# EAGLE design 1541-3z (EAGLE 6.6.0)
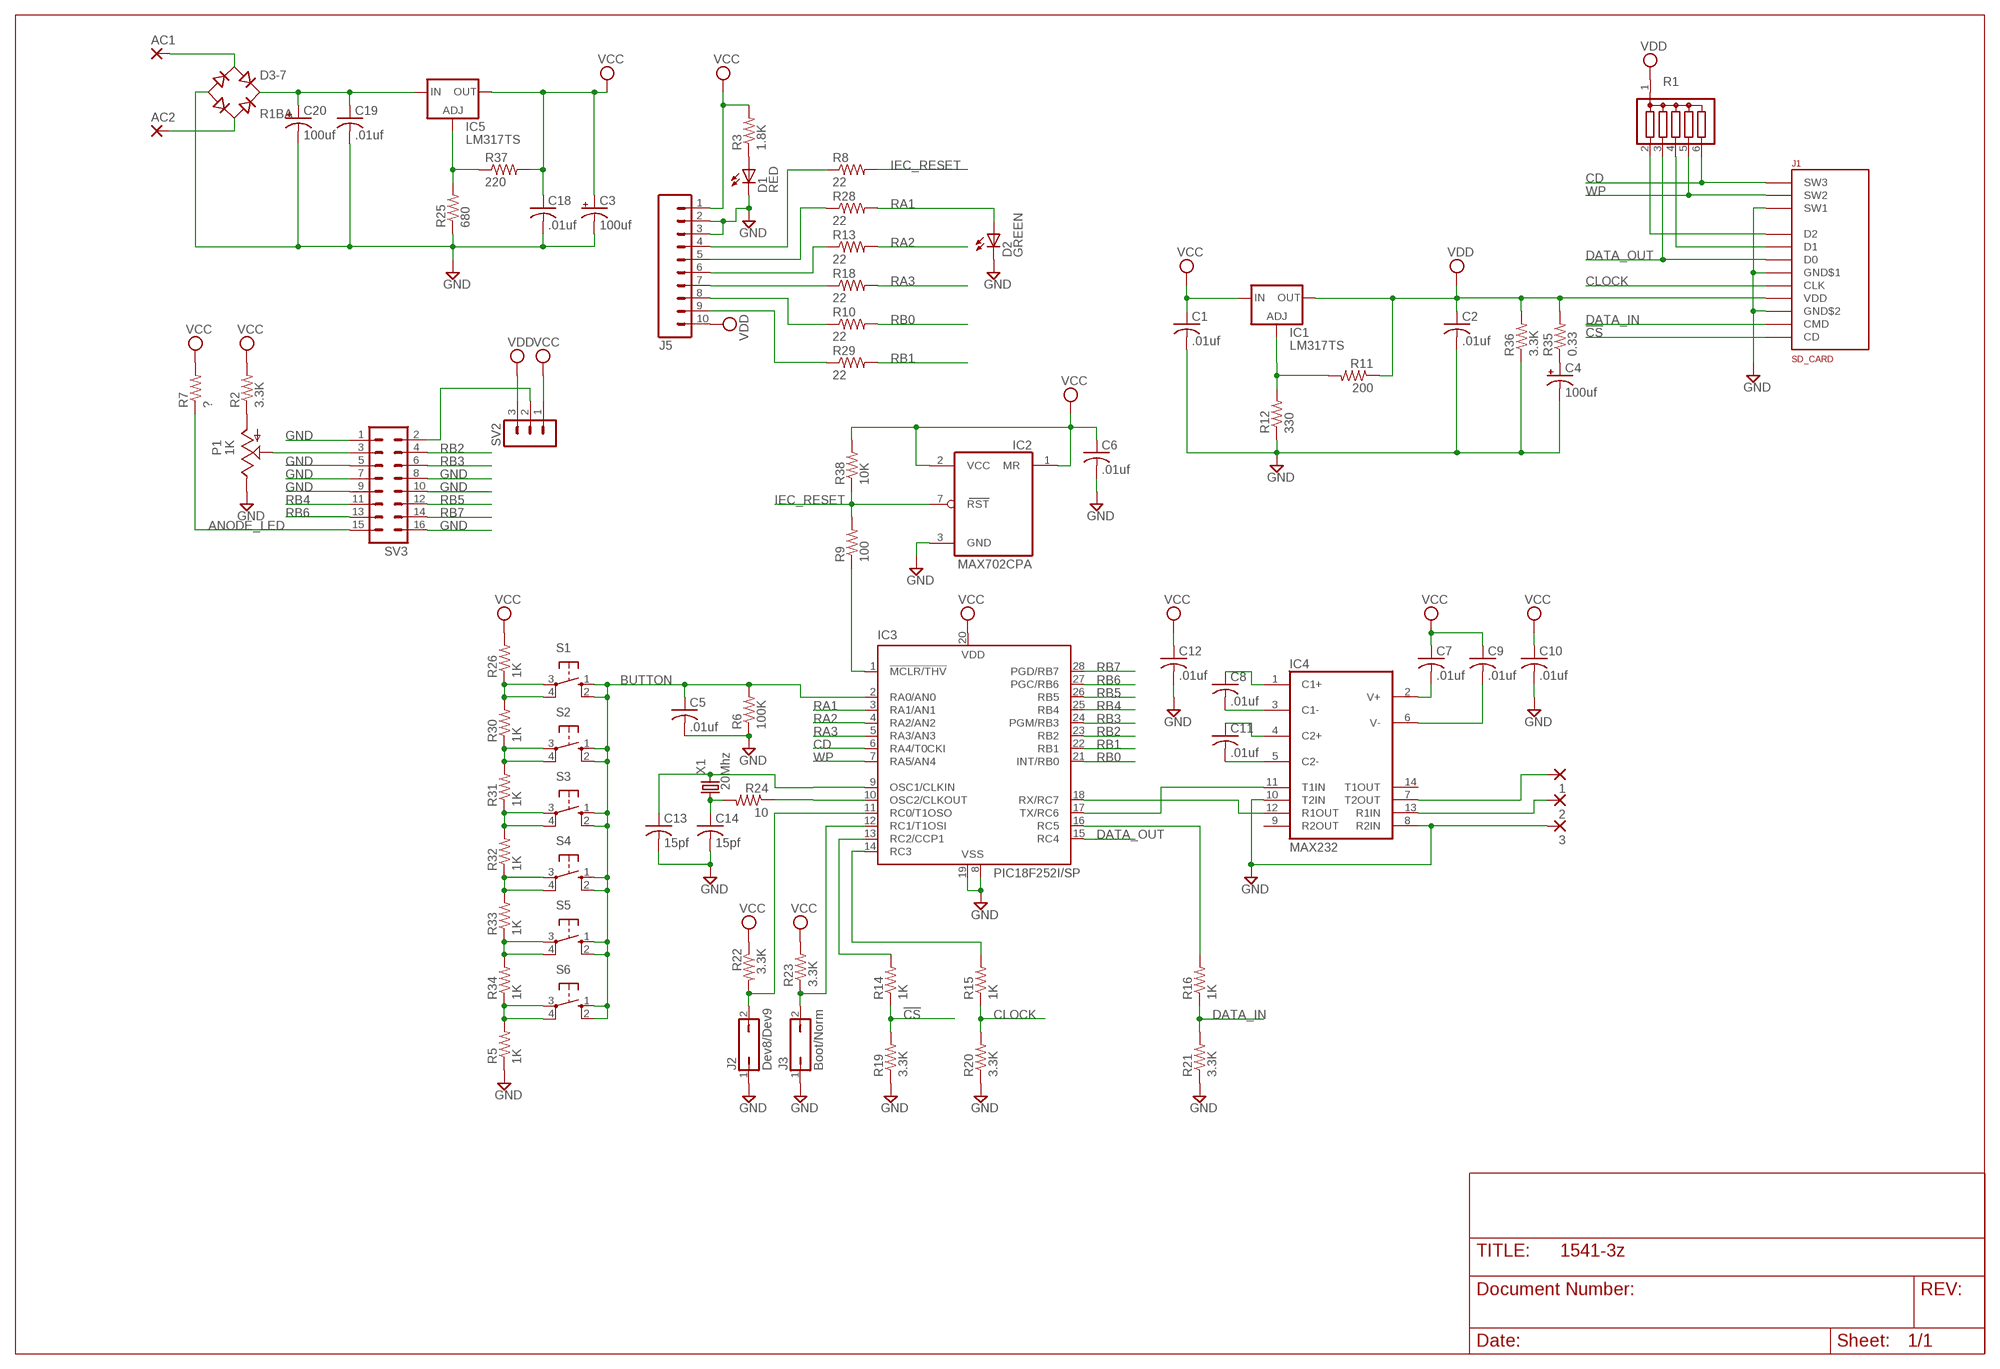
[diagram p0: schematic, sheet 1]

## Parts
1  2,15/1,0  [2,15/1,0]
2  2,15/1,0  [2,15/1,0]
3  2,15/1,0  [2,15/1,0]
AC1  2,15/1,0  [2,15/1,0]
AC2  2,15/1,0  [2,15/1,0]
C1  .01uf  C-US025-024X044  [C025-024X044]
C2  .01uf  C-US025-024X044  [C025-024X044]
C3  100uf  CPOL-USE2-5  [E2-5]
C4  100uf  CPOL-USE2-5  [E2-5]
C5  .01uf  C-US025-024X044  [C025-024X044]
C6  .01uf  C-US025-024X044  [C025-024X044]
C7  .01uf  C-US025-024X044  [C025-024X044]
C8  .01uf  C-US025-024X044  [C025-024X044]
C9  .01uf  C-US025-024X044  [C025-024X044]
C10  .01uf  C-US025-024X044  [C025-024X044]
C11  .01uf  C-US025-024X044  [C025-024X044]
C12  .01uf  C-US025-024X044  [C025-024X044]
C13  15pf  C-US025-024X044  [C025-024X044]
C14  15pf  C-US025-024X044  [C025-024X044]
C18  .01uf  C-US025-024X044  [C025-024X044]
C19  .01uf  C-US025-024X044  [C025-024X044]
C20  100uf  CPOL-USE2-5  [E2-5]
D1  RED  LED3MM  [LED3MM]
D2  GREEN  LED3MM  [LED3MM]
D3-7  R1BA  RB1A  [RB1A]
IC1  LM317TS  [317TS]
IC2  MAX702CPA  [DIL08]
IC3  PIC18F252I/SP  PIC16F870P  [DIL28-3]
IC4  MAX232  [DIL16]
IC5  LM317TS  [317TS]
J1  SD_CARD  [SD_CARD]
J2  Dev8/Dev9  JP1Q  [JP1]
J3  Boot/Norm  JP1Q  [JP1]
J5  M10  [10P]
P1  1K  TRIM_US-LI10  [LI10]
R1  G05R  [SIL6]
R2  3.3K  R-US_0207/2V  [0207/2V]
R3  1.8K  R-US_0207/2V  [0207/2V]
R5  1K  R-US_0207/2V  [0207/2V]
R6  100K  R-US_0207/2V  [0207/2V]
R7  ?  R-US_0207/2V  [0207/2V]
R8  22  R-US_0207/2V  [0207/2V]
R9  100  R-US_0207/2V  [0207/2V]
R10  22  R-US_0207/2V  [0207/2V]
R11  200  R-US_0207/2V  [0207/2V]
R12  330  R-US_0207/2V  [0207/2V]
R13  22  R-US_0207/2V  [0207/2V]
R14  1K  R-US_0207/2V  [0207/2V]
R15  1K  R-US_0207/2V  [0207/2V]
R16  1K  R-US_0207/2V  [0207/2V]
R18  22  R-US_0207/2V  [0207/2V]
R19  3.3K  R-US_0207/2V  [0207/2V]
R20  3.3K  R-US_0207/2V  [0207/2V]
R21  3.3K  R-US_0207/2V  [0207/2V]
R22  3.3K  R-US_0207/2V  [0207/2V]
R23  3.3K  R-US_0207/2V  [0207/2V]
R24  10  R-US_0207/2V  [0207/2V]
R25  680  R-US_0207/2V  [0207/2V]
R26  1K  R-US_0207/2V  [0207/2V]
R28  22  R-US_0207/2V  [0207/2V]
R29  22  R-US_0207/2V  [0207/2V]
R30  1K  R-US_0207/2V  [0207/2V]
R31  1K  R-US_0207/2V  [0207/2V]
R32  1K  R-US_0207/2V  [0207/2V]
R33  1K  R-US_0207/2V  [0207/2V]
R34  1K  R-US_0207/2V  [0207/2V]
R35  0.33  R-US_0207/2V  [0207/2V]
R36  3.3K  R-US_0207/2V  [0207/2V]
R37  220  R-US_0207/2V  [0207/2V]
R38  10K  R-US_0207/2V  [0207/2V]
S1  10-XX  [B3F-10XX]
S2  10-XX  [B3F-10XX]
S3  10-XX  [B3F-10XX]
S4  10-XX  [B3F-10XX]
S5  10-XX  [B3F-10XX]
S6  10-XX  [B3F-10XX]
SV2  MA03-1  [MA03-1]
SV3  ML16  [ML16]
X1  20Mhz  CRYSTALHC49U70  [HC49U70]

## Nets
!CS: J1.DAT3(CD) R14.1 R19.2
ANODE_LED: R7.1 SV3.15
BUTTON: C5.1 IC3.2(RA0/AN0) R6.2 S1.1(S) S1.2(S1) S2.1(S) S2.2(S1) S3.1(S) S3.2(S1) S4.1(S) S4.2(S1) S5.1(S) S5.2(S1) S6.1(S) S6.2(S1)
CD: IC3.6(RA4/T0CKI) J1.SW3 R1.6
CLOCK: J1.CLK R15.1 R20.2
DATA_IN: J1.CMD R16.1 R21.2
DATA_OUT: IC3.15(RC4) J1.DAT0(D0) R1.3
GND: 3.1(P) C1.2 C2.2 C3.- C4.- C5.2 C6.2 C10.2 C12.2 C13.2 C14.2 C18.2 C19.2 C20.- D1.K(C) D2.K(C) D3-7.- IC2.3(GND) IC3.8(VSS) IC3.19(VSS) IC4.8(R2IN) IC4.10(T2IN) J1.SW1 J1.VSS$1(GND$1) J1.VSS$2(GND$2) J2.1 J3.1 J5.2 J5.3 P1.E R5.1 R6.1 R12.1 R19.1 R20.1 R21.1 R25.1 R36.1 SV3.1 SV3.5 SV3.7 SV3.8 SV3.9 SV3.10 SV3.16
IEC_RESET: IC2.7(RST) R8.2 R9.2 R38.1
N$1: C4.+ R35.1
N$2: J1.DAT2(D2) R1.2
N$3: J1.DAT1(D1) R1.4
N$4: J5.9 R29.1
N$5: J5.8 R10.1
N$6: J5.7 R18.1
N$7: J5.4 R8.1
N$8: J5.5 R28.1
N$9: J5.6 R13.1
N$10: D1.A R3.1
N$11: IC3.18(RX/RC7) IC4.12(R1OUT)
N$12: IC3.14(RC3) R15.2
N$13: C14.1 R24.2 X1.1
N$14: IC3.1(!MCLR/THV) R9.1
N$15: C11.1 IC4.4(C2+)
N$16: C11.2 IC4.5(C2-)
N$17: C8.2 IC4.3(C1-)
N$18: C8.1 IC4.1(C1+)
N$19: C7.2 IC4.2(V+)
N$20: C13.1 IC3.9(OSC1/CLKIN) X1.2
N$21: IC3.10(OSC2/CLKOUT) R24.1
N$22: IC3.12(RC1/T1OSI) J3.2 R23.1
N$23: IC3.11(RC0/T1OSO) J2.2 R22.2
N$24: IC3.13(RC2/CCP1) R14.2
N$25: IC3.16(RC5) R16.2
N$26: IC1.1(ADJ) R11.2 R12.2
N$27: IC3.17(TX/RC6) IC4.11(T1IN)
N$28: R26.1 R30.2 S1.3(P) S1.4(P1)
N$29: R30.1 R31.2 S2.3(P) S2.4(P1)
N$30: R31.1 R32.2 S3.3(P) S3.4(P1)
N$31: R5.2 R34.1 S6.3(P) S6.4(P1)
N$32: R33.1 R34.2 S5.3(P) S5.4(P1)
N$33: R32.1 R33.2 S4.3(P) S4.4(P1)
N$34: P1.A R2.1
N$35: SV2.2 SV3.2
N$36: P1.S SV3.3
N$37: C9.2 IC4.6(V-)
N$38: IC5.1(ADJ) R25.2 R37.1
N$39: AC1.1(P) D3-7.AC1
N$40: C19.1 C20.+ D3-7.+ IC5.3(IN)
N$41: AC2.1(P) D3-7.AC2
N$42: 2.1(P) IC4.13(R1IN)
N$43: 1.1(P) IC4.7(T2OUT)
RA1: D2.A IC3.3(RA1/AN1) R28.2
RA2: IC3.4(RA2/AN2) R13.2
RA3: IC3.5(RA3/AN3) R18.2
RB0: IC3.21(INT/RB0) R10.2
RB1: IC3.22(RB1) R29.2
RB2: IC3.23(RB2) SV3.4
RB3: IC3.24(PGM/RB3) SV3.6
RB4: IC3.25(RB4) SV3.11
RB5: IC3.26(RB5) SV3.12
RB6: IC3.27(PGC/RB6) SV3.13
RB7: IC3.28(PGD/RB7) SV3.14
VCC: C1.1 C3.+ C6.1 C7.1 C9.1 C10.1 C12.1 C18.1 IC1.3(IN) IC2.1(MR) IC2.2(VCC) IC3.20(VDD) IC5.2(OUT) J5.1 R2.2 R3.2 R7.2 R22.1 R23.2 R26.2 R37.2 R38.2 SV2.1
VDD: C2.1 IC1.2(OUT) J1.VDD J5.10 R1.1 R11.1 R35.2 R36.2 SV2.3
WP: IC3.7(RA5/AN4) J1.SW2 R1.5
Unconnected: IC4.9(R2OUT) IC4.14(T1OUT)

## Power pins joined to a net without a drawn wire
GND: IC4.15(GND)
VCC: IC4.16(VCC)

## Library data of the parts
1-3 AC1 AC2 = wirepad:2,15/1,0: THROUGH-HOLE PAD
C1 C2 C5-C14 C18 C19 = rcl:C-US: CAPACITOR, American symbol
C3 C4 C20 = rcl:CPOL-US: POLARIZED CAPACITOR, American symbol
D1 D2 = led:LED: LED OSRAM: - CHIPLED LG R971, LG N971, LY N971, LG Q971, LY Q971, LO R971, LY R971 LH N974, LH R974 LS Q976, LO Q976, LY Q976 LO Q996 - Hyper CHIPLED LW Q18S LB Q993, LB Q99A, LB R99A - SideLED LS A670, LO A670, LY A670, LG A670, LP A670 LB A673, LV A673, LT A673, LW A673 LH A674 LY A675 LS A676, LA A676, LO A676, LY A676, LW A676 LS A679, LY A679, LG A679 - Hyper Micro SIDELED® LS Y876, LA Y876, LO Y876, LY Y876 LT Y87S - SmartLED LW L88C, LW L88S LB L89C, LB L89S, LG L890 LS L89K, LO L89K, LY L89K LS L896, LA L896, LO L896, LY L896 - TOPLED LS T670, LO T670, LY T670, LG T670, LP T670 LSG T670, LSP T670, LSY T670, LOP T670, LYG T670 LG T671, LOG T671, LSG T671 LB T673, LV T673, LT T673, LW T673 LH T674 LS T676, LA T676, LO T676, LY T676, LB T676, LH T676, LSB T676, LW T676 LB T67C, LV T67C, LT T67C, LS T67K, LO T67K, LY T67K, LW E67C LS E67B, LA E67B, LO E67B, LY E67B, LB E67C, LV E67C, LT E67C LW T67C LS T679, LY T679, LG T679 LS T770, LO T770, LY T770, LG T770, LP T770 LB T773, LV T773, LT T773, LW T773 LH T774 LS E675, LA E675, LY E675, LS T675 LS T776, LA T776, LO T776, LY T776, LB T776 LHGB T686 LT T68C, LB T68C - Hyper Mini TOPLED® LB M676 - Mini TOPLED Santana® LG M470 LS M47K, LO M47K, LY M47K Source: http://www.osram.convergy.de LUXEON: - LUMILED® LXK2-PW12-R00, LXK2-PW12-S00, LXK2-PW14-U00, LXK2-PW14-V00 LXK2-PM12-R00, LXK2-PM12-S00, LXK2-PM14-U00 LXK2-PE12-Q00, LXK2-PE12-R00, LXK2-PE12-S00, LXK2-PE14-T00, LXK2-PE14-U00 LXK2-PB12-K00, LXK2-PB12-L00, LXK2-PB12-M00, LXK2-PB14-N00, LXK2-PB14-P00, LXK2-PB14-Q00 LXK2-PR12-L00, LXK2-PR12-M00, LXK2-PR14-Q00, LXK2-PR14-R00 LXK2-PD12-Q00, LXK2-PD12-R00, LXK2-PD12-S00 LXK2-PH12-R00, LXK2-PH12-S00 LXK2-PL12-P00, LXK2-PL12-Q00, LXK2-PL12-R00 Source: www.luxeon.com KINGBRIGHT: KA-3528ASYC Source: www.kingbright.com
D3-7 = rectifier:RB1A: RECTIFIER 1 A
IC1 IC5 = v-reg:LM317TS: VOLTAGE REGULATOR
IC2 = maxim:MAX702CPA: POWER SUPPLY MONITOR; MF: MAXIM; MPN: MAX702CPA+; OC_FARNELL: 1188018; OC_NEWARK: 69K6744
IC3 = microchip:PIC16*870: MICROCONTROLLER flash type; MF: MICROCHIP; MPN: PIC16F870-I/SP; OC_FARNELL: 9760954; OC_NEWARK: 19C7275
IC4 = maxim:MAX232: RS232 TRANSCEIVER; MF: MAXIM; MPN: MAX232ACPE+; OC_FARNELL: 9723773; OC_NEWARK: 68K4544
J1 = 1541-III:SD_CARD: SD Card Socket
J2 J3 = jumper:JP1Q: JUMPER
J5 = con-amp-quick:M10: AMP QUICK CONNECTOR; OC_FARNELL: unknown; OC_NEWARK: unknown
P1 = pot:TRIM_US-: POTENTIOMETER
R1 = resistor-sil:G05R: SIL RESISTOR; OC_FARNELL: unknown; OC_NEWARK: unknown
R2 R3 R5-R16 R18-R26 R28-R38 = rcl:R-US_: RESISTOR, American symbol
S1-S6 = switch-omron:10-XX: OMRON SWITCH; MPN: B3F-1000; OC_FARNELL: 176432; OC_NEWARK: 36M3542
SV2 = con-lstb:MA03-1: PIN HEADER; OC_FARNELL: unknown; OC_NEWARK: unknown
SV3 = con-harting-ml:ML16: HARTING; OC_FARNELL: unknown; OC_NEWARK: unknown
X1 = crystal:CRYSTAL: CRYSTAL; OC_FARNELL: unknown; OC_NEWARK: unknown

## Board
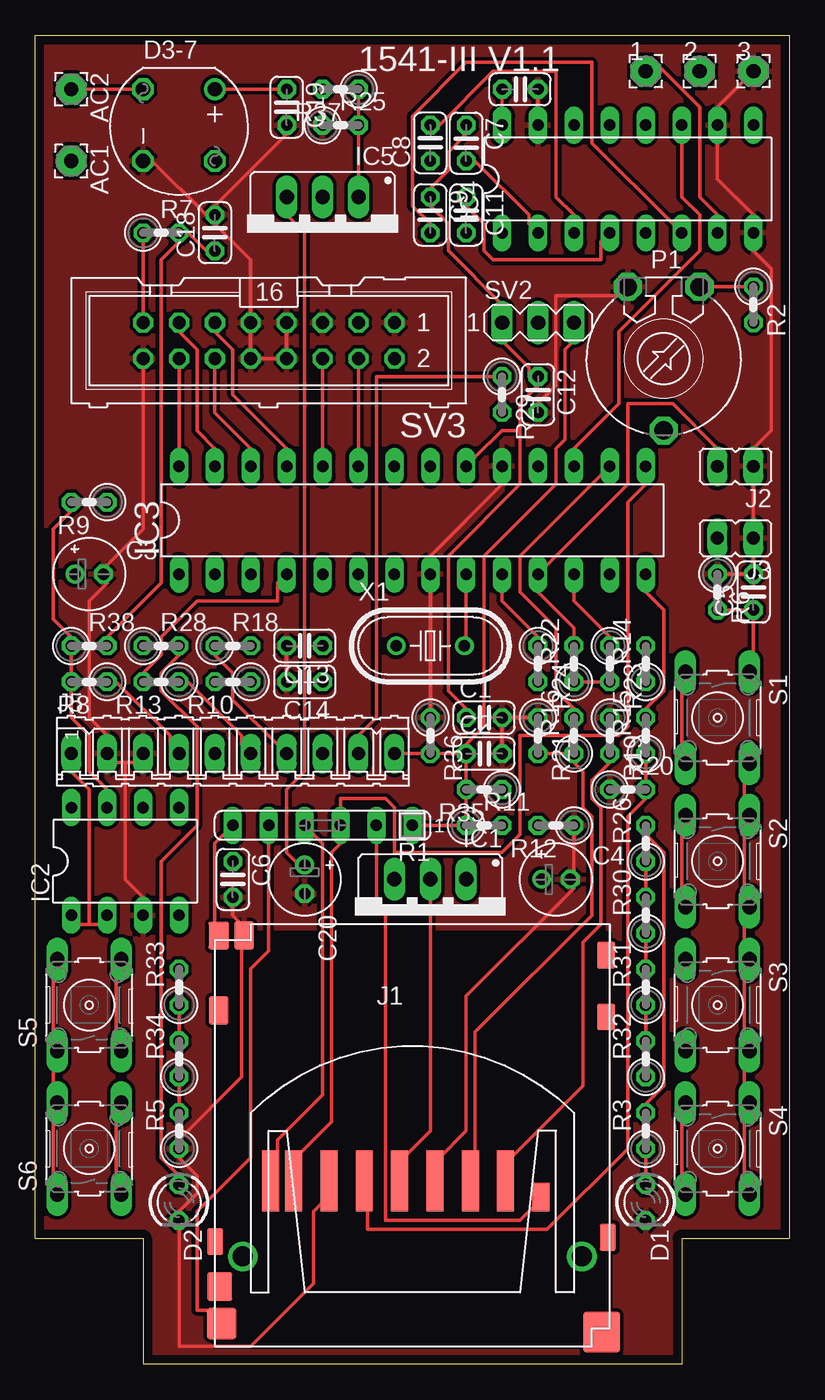
[diagram p1: board, top side]
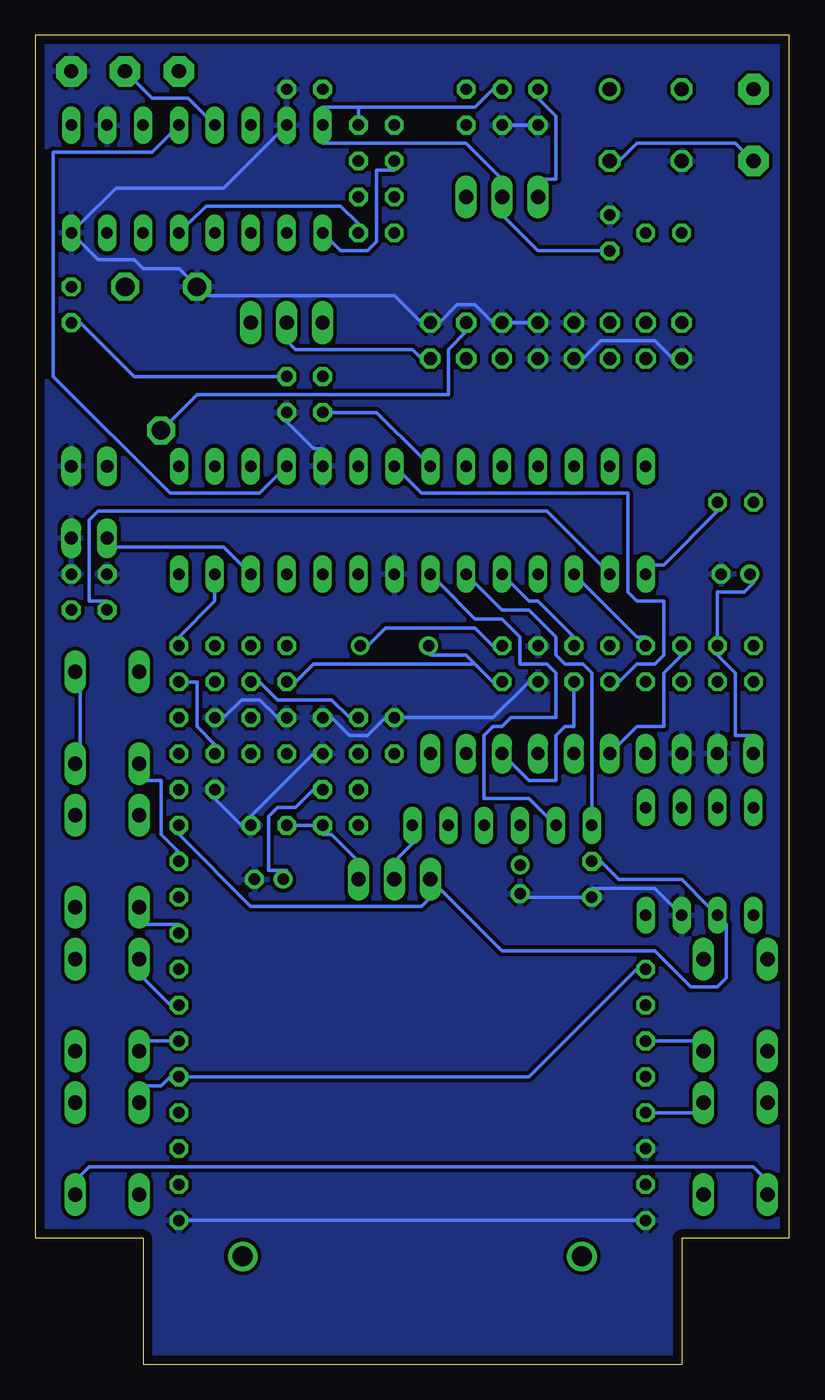
[diagram p2: board, bottom side, seen from below]

Size 53.34 x 93.98 mm. Coordinates in mm from the lower left corner, seen from the top.
Outline: 0,93.98 53.34,93.98 53.34,8.89 45.72,8.89 45.72,0 7.62,0 7.62,8.89 0,8.89 0,93.98
Copper layers (1*16): Top 0.035mm / dielectric 1.5mm / Bottom 0.035mm
Design rules "olimex10mil": minimum track width 10mil, minimum drill 24mil, track to track 10mil, track to pad 10mil, pad to pad 10mil, via to via 10mil, smd to smd 10mil, copper to edge 25mil, drill to drill 10mil, minimum pad ring 10mil, minimum via ring 8mil, stop-mask expansion 0mil, vias tented up to drill 0mil, thermal gap 10mil
tRestrict: area 12.7,1.3 to 40.6,30.5

### Footprints (pad centres in the part's own frame; a part is rotated, then mirrored left to right if it is on the bottom)
2,15/1,0 = drill 1.016 pad 2.159 octagon: 1 0,0
C025-024X044 = drill 0.813 octagon: 1 -1.27,0; 2 1.27,0
E2-5 = drill 0.813 pad 1.27: + -1.016,0 | drill 0.813 pad 1.27 octagon: - 1.016,0
LED3MM = drill 0.813 octagon: A -1.27,0; K 1.27,0
RB1A = drill 1.016: + -2.54,2.54 | drill 1.016 octagon: - 2.54,-2.54; AC1 2.54,2.54; AC2 -2.54,-2.54
317TS = drill 1.016 long: 1 -2.54,-2.54; 2 0,-2.54; 3 2.54,-2.54
DIL08 = drill 0.813 long: 1 -3.81,-3.81; 2 -1.27,-3.81; 3 1.27,-3.81; 4 3.81,-3.81; 5 3.81,3.81; 6 1.27,3.81; 7 -1.27,3.81; 8 -3.81,3.81
DIL28-3 = drill 0.813 long: 1 -16.51,-3.81; 2 -13.97,-3.81; 3 -11.43,-3.81; 4 -8.89,-3.81; 5 -6.35,-3.81; 6 -3.81,-3.81; 7 -1.27,-3.81; 8 1.27,-3.81; 9 3.81,-3.81; 10 6.35,-3.81; 11 8.89,-3.81; 12 11.43,-3.81; 13 13.97,-3.81; 14 16.51,-3.81; 15 16.51,3.81; 16 13.97,3.81; 17 11.43,3.81; 18 8.89,3.81; 19 6.35,3.81; 20 3.81,3.81; 21 1.27,3.81; 22 -1.27,3.81; 23 -3.81,3.81; 24 -6.35,3.81; 25 -8.89,3.81; 26 -11.43,3.81; 27 -13.97,3.81; 28 -16.51,3.81
DIL16 = drill 0.813 long: 1 -8.89,-3.81; 2 -6.35,-3.81; 3 -3.81,-3.81; 4 -1.27,-3.81; 5 1.27,-3.81; 6 3.81,-3.81; 7 6.35,-3.81; 8 8.89,-3.81; 9 8.89,3.81; 10 6.35,3.81; 11 3.81,3.81; 12 1.27,3.81; 13 -1.27,3.81; 14 -3.81,3.81; 15 -6.35,3.81; 16 -8.89,3.81
SD_CARD = smd 1.2 x 4.3: CLK -3.4,5.34; CMD 4.1,5.34; DAT0 -8.4,5.34; DAT1 -10.025,5.34; DAT3 6.6,5.34; VDD -0.9,5.34; VSS$1 1.6,5.34; VSS$2 -5.9,5.34 | smd 1.2 x 2: DAT2 9.1,4.19 | smd 1.4 x 1.95: GND$1 -13.7,17.4; SW1 -11.9,22.7 | smd 1.143 x 1.905: GND$2 -13.954,1.05; GND$6 13.827,1.35 | smd 1.778 x 2.032: GND$3 -13.627,-2.127 | smd 1.3 x 1.9: GND$4 13.7,21.3; GND$5 13.7,16.95 | smd 2.6 x 2.9: GND$7 13.4,-5.35 | drill 1.4 pad 1.5: GND$8 -12,0; GND$9 12,0 | smd 2.1 x 2.2: SW2 -13.5,-4.75 | smd 1.45 x 1.95: SW3 -13.7,22.7
JP1 = drill 0.914 long: 1 0,-1.27; 2 0,1.27
10P = drill 0.914 long: 1 -11.43,0; 2 -8.89,0; 3 -6.35,0; 4 -3.81,0; 5 -1.27,0; 6 1.27,0; 7 3.81,0; 8 6.35,0; 9 8.89,0; 10 11.43,0
LI10 = drill 1.321 octagon: A -2.54,-5.08; E 2.54,-5.08; S 0,5.08
SIL6 = drill 0.813 long: 1 -6.35,0; 2 -3.81,0; 3 -1.27,0; 4 1.27,0; 5 3.81,0; 6 6.35,0
0207/2V = drill 0.813 octagon: 1 -1.27,0; 2 1.27,0
B3F-10XX = drill 1.016 long: 1 -3.251,2.261; 2 3.251,2.261; 3 -3.251,-2.261; 4 3.251,-2.261
MA03-1 = drill 1.016 long: 1 -2.54,0; 2 0,0; 3 2.54,0
ML16 = drill 0.914 octagon: 1 -8.89,-1.27; 2 -8.89,1.27; 3 -6.35,-1.27; 4 -6.35,1.27; 5 -3.81,-1.27; 6 -3.81,1.27; 7 -1.27,-1.27; 8 -1.27,1.27; 9 1.27,-1.27; 10 1.27,1.27; 11 3.81,-1.27; 12 3.81,1.27; 13 6.35,-1.27; 14 6.35,1.27; 15 8.89,-1.27; 16 8.89,1.27
HC49U70 = drill 0.813: 1 -2.413,0; 2 2.413,0

### Placement (x,y rotation side)
1  43.18,91.44 0 top
2  46.99,91.44 0 top
3  50.8,91.44 0 top
AC1  2.54,85.09 270 top
AC2  2.54,90.17 270 top
C1  31.75,45.72 0 top
C2  31.75,43.18 0 top
C3  3.81,55.88 0 top
C4  36.83,34.29 0 top
C5  50.8,54.61 90 top
C6  13.97,34.29 270 top
C7  30.48,86.36 270 top
C8  27.94,86.36 90 top
C9  27.94,81.28 270 top
C10  34.29,90.17 0 top
C11  30.48,81.28 270 top
C12  35.56,68.58 270 top
C13  19.05,50.8 180 top
C14  19.05,48.26 180 top
C18  12.7,80.01 90 top
C19  17.78,88.9 270 top
C20  19.05,34.29 270 top
D1  43.18,11.43 270 top
D2  10.16,11.43 270 top
D3-7  10.16,87.63 270 top
IC1  27.94,31.75 180 top
IC2  6.35,35.56 0 top
IC3  26.67,59.69 0 top
IC4  41.91,83.82 0 top
IC5  20.32,80.01 180 top
J1  26.67,7.62 0 top
J2  49.53,63.5 90 top
J3  49.53,58.42 90 top
J5  13.97,43.18 0 top
P1  44.45,71.12 180 top
R1  20.32,38.1 180 top
R2  50.8,74.93 270 top
R3  43.18,16.51 90 top
R5  10.16,16.51 90 top
R6  48.26,54.61 270 top
R7  8.89,80.01 0 top
R8  3.81,48.26 180 top
R9  3.81,60.96 180 top
R10  13.97,48.26 180 top
R11  31.75,38.1 0 top
R12  36.83,38.1 180 top
R13  8.89,48.26 180 top
R14  43.18,49.53 90 top
R15  43.18,44.45 90 top
R16  38.1,44.45 90 top
R18  13.97,50.8 0 top
R19  40.64,44.45 270 top
R20  41.91,40.64 0 top
R21  35.56,44.45 270 top
R22  38.1,49.53 90 top
R23  40.64,49.53 270 top
R24  35.56,49.53 270 top
R25  21.59,87.63 0 top
R26  43.18,36.83 90 top
R28  8.89,50.8 0 top
R29  33.02,68.58 270 top
R30  43.18,31.75 90 top
R31  43.18,26.67 90 top
R32  43.18,21.59 90 top
R33  10.16,26.67 90 top
R34  10.16,21.59 90 top
R35  31.75,40.64 180 top
R36  27.94,44.45 270 top
R37  21.59,90.17 180 top
R38  3.81,50.8 0 top
S1  48.26,45.72 270 top
S2  48.26,35.56 270 top
S3  48.26,25.4 270 top
S4  48.26,15.24 270 top
S5  3.81,25.4 90 top
S6  3.81,15.24 90 top
SV2  35.56,73.66 0 top
SV3  16.51,72.39 180 top
X1  27.94,50.8 0 top

### Tracks (layer width: path | path; a pad name or v marks a point on that pad's centre or on a via)
!CS
  Top 0.254: J1.DAT3 33.66,14.61 38.73,19.68 38.73,29.84 40.01,31.11 40.01,39.37 39.37,40.01 39.37,41.27 40.64,42.55 R19.2
  Bottom 0.254: R19.2 40.64,43.81 41.91,45.09 41.91,48.26 42.55,48.26 R14.1
ANODE_LED
  Top 0.254: R7.1 7.62,79.38 7.62,74.3 SV3.15
BUTTON
  Top 0.254: R6.2 48.9,53.34 50.16,53.34 C5.1 50.8,52.7 50.8,50.16 S1.1 | S6.1 1.27,13.34 1.27,17.14 S6.2 1.27,19.68 1.27,20.95 S5.1 1.27,23.5 1.27,27.3 S5.2 | S1.2 50.16,41.27 50.16,40.01 S2.1 50.16,37.47 50.16,33.66 S2.2 50.16,31.11 50.16,29.84 S3.1 50.16,27.3 50.16,23.5 S3.2 50.16,20.95 50.16,19.68 S4.1 50.16,17.14 50.16,13.34 S4.2
  Bottom 0.254: IC3.2 13.34,56.52 17.14,60.33 48.9,60.33 49.53,59.69 49.53,53.98 48.26,53.98 R6.2 | S6.1 1.91,13.34 2.54,13.97 49.53,13.97 50.16,13.34 S4.2 | S1.1 50.16,47.62 50.16,43.81 S1.2
CD
  Top 0.254: J1.SW3 12.7,31.11 12.7,36.83 13.34,37.47 R1.6
  Bottom 0.254: IC3.6 22.23,55.24 20.32,53.34 18.41,53.34 16.51,51.44 16.51,50.16 15.88,49.53 14.61,49.53 13.97,48.9 13.97,39.37 R1.6
CLOCK
  Top 0.254: R15.1 43.18,42.55 43.18,41.27 R20.2 43.18,40.01 41.91,38.73 41.91,15.24 36.2,9.53 23.5,9.53 23.5,11.43 J1.CLK
DATA_IN
  Top 0.254: R21.2 36.2,43.18 37.47,43.18 R16.1 38.1,42.55 38.73,41.91 38.73,39.37 39.37,38.73 39.37,31.75 31.11,23.5 31.11,14.61 J1.CMD
DATA_OUT
  Top 0.254: J1.DAT0 18.41,14.61 20.95,17.14 20.95,36.2 21.59,36.83 R1.3 21.59,39.37 21.59,40.01 24.77,40.01 25.4,39.37 25.4,36.2 33.02,36.2 34.29,37.47 34.29,44.45 41.27,44.45 41.91,45.09 41.91,60.96 43.18,62.23 IC3.15
GND
  Top 0.254: R12.1 38.1,37.47 38.1,34.92 C4.- 38.1,33.66 30.48,26.04 30.48,16.51 28.57,14.61 J1.VSS$1 | IC3.19 33.02,62.23 27.94,57.15 IC3.8 27.94,54.61 27.94,46.35 R36.1 | C14.2 17.78,48.9 17.78,50.16 C13.2 | C2.2 33.02,43.81 33.02,45.09 C1.2 33.66,45.72 34.92,45.72 R21.1 | J1.VSS$2 20.32,11.43 19.68,10.79 19.68,5.71 15.24,1.27 10.16,1.27 10.16,9.53 D2.K 10.16,10.79 11.43,12.06 11.43,13.34 10.16,14.61 R5.1 10.16,15.88 14.61,20.32 14.61,29.84 J1.SW1 14.61,31.11 13.97,31.75 13.97,32.38 C6.2 | 6.35,42.55 5.71,42.55 J5.2 5.08,44.45 3.81,45.72 3.81,53.98 5.08,55.24 C3.- 5.08,56.52 7.62,59.05 7.62,70.48 SV3.16 | 6.35,42.55 6.99,42.55 J5.3 | 6.35,42.55 6.35,34.29 7.62,33.02 IC2.3 | C18.2 12.06,81.28 8.26,85.09 D3-7.- | C19.2 17.78,87 12.7,81.92 C18.2 | SV3.7 17.78,73.03 17.78,71.75 SV3.8 17.14,71.12 15.88,71.12 SV3.10 15.24,71.75 15.24,73.03 SV3.9 15.24,74.3 15.24,78.11 12.7,80.64 C18.2 | R6.1 48.9,55.88 50.16,55.88 C5.2 50.8,56.52 50.8,57.15 J3.1 50.8,59.69 50.8,62.23 J2.1 50.8,64.77 52.07,66.04 52.07,77.47 50.8,78.74 IC4.8 50.8,81.28 48.26,83.82 48.26,86.36 IC4.10 48.26,88.9 50.16,90.81 3.1 | IC4.15 35.56,88.9 35.56,89.53 C10.2 | C12.2 35.56,67.94 36.83,69.22 36.83,75.56 41.27,75.56 P1.E
  Bottom 0.254: R20.1 40.64,40.01 38.73,38.1 R12.1 38.1,38.73 33.66,43.18 C2.2 | C12.2 35.56,66.67 33.66,64.77 33.02,64.77 IC3.19 | C1.2 32.38,45.72 31.11,44.45 29.84,44.45 28.57,45.72 R36.1 27.3,45.72 20.95,45.72 18.41,48.26 C14.2 | R19.1 40.01,45.72 38.73,46.99 37.47,46.99 36.2,45.72 R21.1 | D1.K 42.55,10.16 10.79,10.16 D2.K | IC2.3 8.26,32.38 9.53,33.66 13.97,33.66 C6.2 14.61,33.02 18.41,33.02 C20.- | C19.2 18.41,87.63 19.68,87.63 R25.1 | SV3.16 8.26,71.12 9.53,72.39 13.34,72.39 14.61,71.12 SV3.10 | SV3.7 18.41,73.66 19.68,73.66 SV3.5 20.95,73.66 22.23,74.93 23.5,74.93 24.77,73.66 SV3.1 26.04,73.66 27.94,75.56 41.27,75.56 P1.E 42.55,76.83 43.18,77.47 45.72,77.47 46.35,78.11 48.9,78.11 50.16,79.38 IC4.8 50.16,80.64 47.62,83.19 40.01,83.19 36.2,87 IC4.15
  pour Top: 53.34,0 0,0 0,93.98 53.34,93.98
  pour Bottom: 53.34,0 0,0 0,93.98 53.34,93.98
IEC_RESET
  Top 0.254: IC2.7 5.08,40.64 3.81,41.91 3.81,44.45 2.54,45.72 2.54,47.62 R8.2 2.54,48.9 2.54,50.16 R38.1 2.54,51.44 1.27,52.7 1.27,59.05 2.54,60.33 R9.2
N$1
  Bottom 0.254: R35.1 33.66,40.64 34.92,39.37 36.2,39.37 36.83,38.73 36.83,34.92 35.56,34.92 C4.+
N$2
  Top 0.254: J1.DAT2 35.56,11.43 34.29,10.16 24.77,10.16 24.77,31.75 24.13,32.38 24.13,36.83 R1.2
N$3
  Top 0.254: R1.4 19.68,37.47 20.32,36.83 20.32,19.05 17.14,15.88 17.14,14.61 J1.DAT1
N$4
  Top 0.254: R29.1 32.38,69.85 24.13,69.85 24.13,45.72 22.86,44.45 J5.9
N$5
  Bottom 0.254: R10.1 15.24,47.62 15.24,45.09 15.88,45.09 16.51,44.45 16.51,41.27 18.41,41.27 19.68,42.55 J5.8
N$6
  Top 0.254: R18.1 12.7,50.16 13.97,48.9 13.97,46.99 17.14,43.81 J5.7
N$7
  Top 0.254: R8.1 5.71,48.26 9.53,44.45 9.53,43.81 J5.4
N$8
  Bottom 0.254: R28.1 7.62,50.16 8.89,48.9 8.89,45.09 10.79,45.09 12.06,43.81 J5.5
N$9
  Top 0.254: R13.1 10.79,48.26 14.61,44.45 14.61,43.81 J5.6
N$10
  Top 0.254: D1.A 43.18,13.34 43.18,14.61 R3.1
N$11
  Bottom 0.254: IC3.18 36.2,62.87 37.47,61.59 43.81,61.59 52.07,69.85 52.07,85.72 45.09,85.72 43.81,87 IC4.12
N$12
  Top 0.254: R15.2 43.18,46.35 44.45,47.62 44.45,53.34 43.18,54.61 IC3.14
N$13
  Bottom 0.254: 22.23,49.53 22.86,50.16 25.4,50.16 X1.1 | 22.23,49.53 20.95,48.26 C14.1 | 22.23,49.53 33.66,49.53 34.92,48.26 R24.2
N$14
  Bottom 0.254: R9.1 5.08,60.33 8.89,56.52 9.53,56.52 IC3.1
N$15
  Top 0.254: C11.1 30.48,81.92 31.75,80.64 31.75,78.74 32.38,78.11 40.01,78.11 40.01,79.38 IC4.4
N$16
  Bottom 0.254: C11.2 30.48,80.64 31.75,81.92 41.27,81.92 42.55,80.64 IC4.5
N$17
  Top 0.254: C8.2 28.57,87.63 32.38,91.44 36.83,91.44 36.83,82.55 38.1,81.28 IC4.3
N$18
  Bottom 0.254: IC4.1 32.38,79.38 31.75,78.74 29.84,78.74 29.21,79.38 29.21,84.45 27.94,84.45 C8.1
N$19
  Top 0.254: C7.2 31.11,85.09 34.92,81.28 34.92,80.64 IC4.2
N$20
  Top 0.254: IC3.9 30.48,54.61 30.48,51.44 X1.2
  Bottom 0.254: C13.1 20.95,50.8 22.23,52.07 28.57,52.07 29.84,50.8 X1.2
N$21
  Top 0.254: R24.1 35.56,51.44 33.02,53.98 33.02,54.61 IC3.10
N$22
  Top 0.254: R23.1 40.64,51.44 38.1,53.98 38.1,54.61 IC3.12
  Bottom 0.254: J3.2 47.62,57.78 40.01,57.78 38.73,56.52 IC3.12
N$23
  Top 0.254: R22.2 38.1,51.44 38.1,52.07 35.56,54.61 IC3.11 36.2,56.52 41.91,62.23 41.91,67.94 45.09,67.94 48.26,64.77 J2.2
N$24
  Bottom 0.254: R14.2 43.18,51.44 40.64,53.98 40.64,54.61 IC3.13
N$25
  Top 0.254: R16.2 38.1,46.35 36.83,47.62 36.83,52.07 34.29,54.61 34.29,57.15 40.01,62.87 IC3.16
N$26
  Bottom 0.254: R12.2 34.92,38.1 33.66,38.1 R11.2 33.02,37.47 32.38,37.47 30.48,35.56 IC1.1
N$27
  Top 0.254: IC3.17 38.1,64.77 41.27,67.94 41.27,73.03 46.99,78.74 46.99,81.28 45.72,82.55 45.72,86.36 IC4.11
N$28
  Top 0.254: R30.2 43.18,33.66 43.18,34.92 R26.1 | S1.4 45.72,43.81 45.72,47.62 S1.3
  Bottom 0.254: R26.1 43.18,36.2 44.45,37.47 44.45,41.27 45.72,41.27 S1.4
N$29
  Top 0.254: R31.2 43.18,28.57 43.18,29.84 R30.1 | S2.3 45.72,37.47 45.72,33.66 S2.4
  Bottom 0.254: S2.4 45.72,31.11 43.18,31.11 R30.1
N$30
  Top 0.254: R32.2 43.18,23.5 43.18,24.77 R31.1
  Bottom 0.254: S3.4 45.72,22.86 43.81,22.86 R32.2 | S3.3 45.72,27.3 43.81,25.4 R31.1
N$31
  Top 0.254: R5.2 10.16,18.41 10.16,19.68 R34.1 | S6.3 5.71,13.34 5.71,17.14 S6.4
  Bottom 0.254: R5.2 9.53,17.78 6.35,17.78 S6.4
N$32
  Top 0.254: R34.2 10.16,23.5 10.16,24.77 R33.1 | S5.4 5.71,27.3 5.71,23.5 S5.3
  Bottom 0.254: S5.3 6.35,22.86 9.53,22.86 R34.2
N$33
  Top 0.254: S4.4 45.72,13.34 45.72,17.14 S4.3
  Bottom 0.254: S4.3 45.72,19.68 44.45,19.68 43.81,20.32 R32.1 42.55,20.32 18.41,20.32 10.79,27.94 R33.2
N$34
  Top 0.254: R2.1 50.16,76.2 47.62,76.2 P1.A
N$35
  Bottom 0.254: SV3.2 26.04,71.12 26.67,71.75 34.92,71.75 35.56,72.39 SV2.2
N$36
  Bottom 0.254: SV3.3 22.86,73.03 24.13,71.75 24.13,68.58 41.91,68.58 43.81,66.67 P1.S
N$37
  Top 0.254: C9.2 27.94,80.64 26.67,81.92 26.67,88.27 30.48,92.08 39.37,92.08 39.37,86.36 45.09,80.64 IC4.6
N$38
  Top 0.254: R37.1 22.86,89.53 22.86,88.27 R25.2 22.86,87 22.86,83.82 IC5.1
N$39
  Bottom 0.254: D3-7.AC1 12.06,85.09 10.79,86.36 3.81,86.36 3.17,85.72 AC1.1
N$40
  Top 0.254: C19.1 17.14,90.17 13.34,90.17 D3-7.+ | C20.+ 18.41,35.56 17.78,36.2 17.78,40.64 19.05,41.91 19.05,80.01 17.78,81.28 IC5.3
  Bottom 0.254: C19.1 17.78,89.53 16.51,88.27 16.51,83.82 17.78,83.82 IC5.3
N$41
  Top 0.254: D3-7.AC2 6.99,90.17 3.17,90.17 AC2.1
N$42
  Bottom 0.254: IC4.13 41.27,88.27 42.55,89.53 45.09,89.53 46.35,90.81 2.1
N$43
  Top 0.254: IC4.7 48.26,81.28 46.99,82.55 46.99,88.9 43.81,92.08 1.1
RA1
  Top 0.254: D2.A 10.16,13.34 8.89,14.61 8.89,35.56 11.43,38.1 11.43,45.09 8.89,47.62 8.89,48.9 10.16,50.16 R28.2
  Bottom 0.254: IC3.3 14.61,55.24 10.79,51.44 10.16,51.44 R28.2
RA2
  Top 0.254: R13.2 7.62,48.9 8.89,50.16 8.89,51.44 11.43,53.98 17.14,53.98 17.14,55.24 IC3.4
RA3
  Bottom 0.254: R18.2 15.24,51.44 17.78,53.98 18.41,53.98 19.68,55.24 IC3.5
RB0
  Bottom 0.254: R10.2 12.06,48.26 10.79,49.53 9.53,49.53 8.89,50.16 8.89,53.98 10.79,53.98 11.43,54.61 11.43,61.59 26.04,61.59 27.3,62.87 IC3.21
RB1
  Bottom 0.254: IC3.22 26.04,64.14 29.21,67.31 32.38,67.31 R29.2
RB2
  Top 0.254: IC3.23 22.86,64.77 22.86,70.48 SV3.4
RB3
  Top 0.254: IC3.24 20.32,64.77 20.32,70.48 SV3.6
RB4
  Top 0.254: IC3.25 17.78,64.77 13.97,68.58 13.97,71.75 12.7,73.03 SV3.11
RB5
  Top 0.254: IC3.26 15.24,64.77 12.7,67.31 12.7,70.48 SV3.12
RB6
  Top 0.254: IC3.27 12.7,64.77 11.43,66.04 11.43,71.75 10.16,73.03 SV3.13
RB7
  Top 0.254: IC3.28 10.16,64.77 10.16,70.48 SV3.14
VCC
  Top 0.254: R3.2 43.18,18.41 44.45,19.68 44.45,36.2 43.18,37.47 R26.2 | 3.81,31.11 4.45,31.11 IC2.2 | 3.81,31.11 3.17,31.11 IC2.1 | 3.81,31.11 3.81,40.64 2.54,41.91 J5.1 | C18.1 12.06,78.74 10.79,80.01 R7.2 10.16,79.38 8.89,78.11 8.89,55.24 5.08,51.44 R38.2 | C7.1 30.48,87 29.21,85.72 29.21,84.45 27.94,83.19 C9.1 27.94,81.92 29.21,80.64 29.21,78.74 33.02,74.93 SV2.1 33.02,72.39 34.92,70.48 34.92,69.85 C12.1 35.56,69.22 34.29,67.94 34.29,66.04 | C10.1 33.02,89.53 33.02,88.9 IC4.16 | R23.2 40.01,48.26 38.73,48.26 R22.1 | 34.29,66.04 33.02,66.04 31.11,64.14 IC3.20 | 34.29,66.04 34.29,62.23 29.21,57.15 29.21,47.62 30.48,46.35 C1.1
  Bottom 0.254: R26.2 43.18,37.47 38.1,32.38 26.04,32.38 25.4,33.02 IC1.3 24.77,33.66 20.32,29.21 9.53,29.21 6.99,26.67 5.08,26.67 4.45,27.3 4.45,31.11 IC2.2 5.71,32.38 7.62,34.29 12.06,34.29 13.34,35.56 C6.1 | C3.+ 2.54,55.24 3.17,54.61 5.08,54.61 5.08,51.44 R38.2 5.08,50.16 3.81,48.9 3.81,44.45 2.54,44.45 J5.1 | C18.1 13.34,78.74 17.78,78.74 20.32,81.28 IC5.2 20.32,83.82 22.86,86.36 33.02,86.36 IC4.16 33.02,88.9 30.48,88.9 | 30.48,88.9 22.23,88.9 20.95,90.17 R37.2 | 30.48,88.9 30.48,88.27 C7.1 | C1.1 31.11,45.72 32.38,46.99 36.2,46.99 37.47,48.26 R22.1 | R2.2 50.16,73.66 46.35,69.85 36.2,69.85 C12.1
VDD
  Top 0.254: J1.VDD 26.04,14.61 27.94,16.51 27.94,33.02 IC1.2 | J5.10 26.04,43.18 27.3,43.18 R36.2 28.57,43.18 29.84,43.18 C2.1 | C2.1 30.48,42.55 30.48,41.27 R35.2 30.48,40.01 30.48,38.73 R11.1 29.84,38.1 27.3,38.1 R1.1 | SV2.3 38.1,72.39 37.47,71.75 37.47,65.41 36.83,64.77 36.83,62.23 31.75,57.15 31.75,45.09 30.48,43.81 C2.1
  Bottom 0.254: R1.1 26.67,36.83 27.94,35.56 IC1.2
WP
  Top 0.254: J1.SW2 12.7,3.81 11.43,3.81 11.43,10.79 15.24,14.61 15.24,27.94 16.51,29.21 16.51,36.83 R1.5
  Bottom 0.254: IC3.7 24.77,55.24 22.23,52.7 20.32,52.7 19.05,51.44 19.05,49.53 17.14,49.53 16.51,48.9 16.51,45.72 19.68,45.72 20.32,45.09 20.95,45.09 21.59,44.45 21.59,40.01 18.41,40.01 17.14,38.73 R1.5

### Text on the board
tPlace: 1541-III V1.1